# Altium schematic sheet drivers.schdoc
size 144 x 76 mm
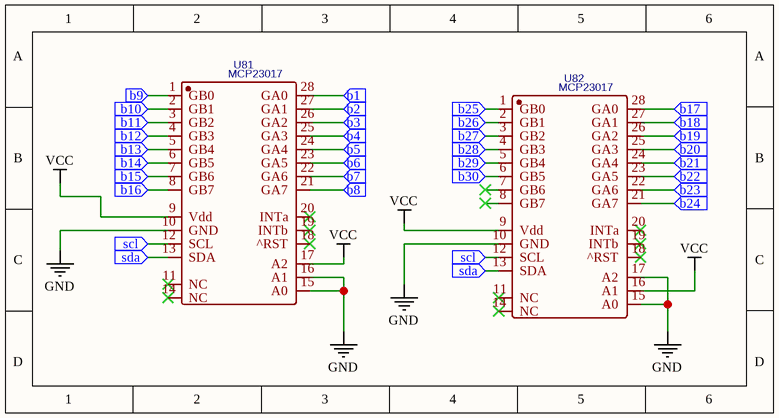
[diagram p0: drivers.schdoc]

## Parts
U81  MCP23017  [DIP-28_300MIL]
U82  MCP23017  [DIP-28_300MIL]

## Ports
b1 (in), b2 (in), b3 (in), b4 (in), b5 (in), b6 (in), b7 (in), b8 (in), b9 (in), b10 (in), b11 (in), b12 (in), b13 (in), b14 (in), b15 (in), b16 (in), b17 (in), b18 (in), b19 (in), b20 (in), b21 (in), b22 (in), b23 (in), b24 (in), b25 (in), b26 (in), b27 (in), b28 (in), b29 (in), b30 (in), scl (in), sda (in)

## Nets
GND: U81.10(GND) U81.15(A0) U81.16(A1) U82.10(GND) U82.15(A0) U82.17(A2)
VCC: U81.9(Vdd) U81.17(A2) U82.9(Vdd) U82.16(A1)
b1: U81.28(GA0) ; port b1
b2: U81.27(GA1) ; port b2
b3: U81.26(GA2) ; port b3
b4: U81.25(GA3) ; port b4
b5: U81.24(GA4) ; port b5
b6: U81.23(GA5) ; port b6
b7: U81.22(GA6) ; port b7
b8: U81.21(GA7) ; port b8
b9: U81.1(GB0) ; port b9
b10: U81.2(GB1) ; port b10
b11: U81.3(GB2) ; port b11
b12: U81.4(GB3) ; port b12
b13: U81.5(GB4) ; port b13
b14: U81.6(GB5) ; port b14
b15: U81.7(GB6) ; port b15
b16: U81.8(GB7) ; port b16
b17: U82.28(GA0) ; port b17
b18: U82.27(GA1) ; port b18
b19: U82.26(GA2) ; port b19
b20: U82.25(GA3) ; port b20
b21: U82.24(GA4) ; port b21
b22: U82.23(GA5) ; port b22
b23: U82.22(GA6) ; port b23
b24: U82.21(GA7) ; port b24
b25: U82.1(GB0) ; port b25
b26: U82.2(GB1) ; port b26
b27: U82.3(GB2) ; port b27
b28: U82.4(GB3) ; port b28
b29: U82.5(GB4) ; port b29
b30: U82.6(GB5) ; port b30
scl: U81.12(SCL) U82.12(SCL) ; port scl
sda: U81.13(SDA) U82.13(SDA) ; port sda

Not connected (* = marked no-connect by the designer): U81 11(NC)* 14(NC)* 18(^RST)* 19(INTb)* 20(INTa)*; U82 7(GB6)* 8(GB7)* 11(NC)* 14(NC)* 18(^RST)* 19(INTb)* 20(INTa)*

## Library data of the parts
U81 U82 = MCP23017: nameAlias: Model; catid: 20; Contributor: tsvstar; spicePre: X; spiceSymbolName: MCP23017